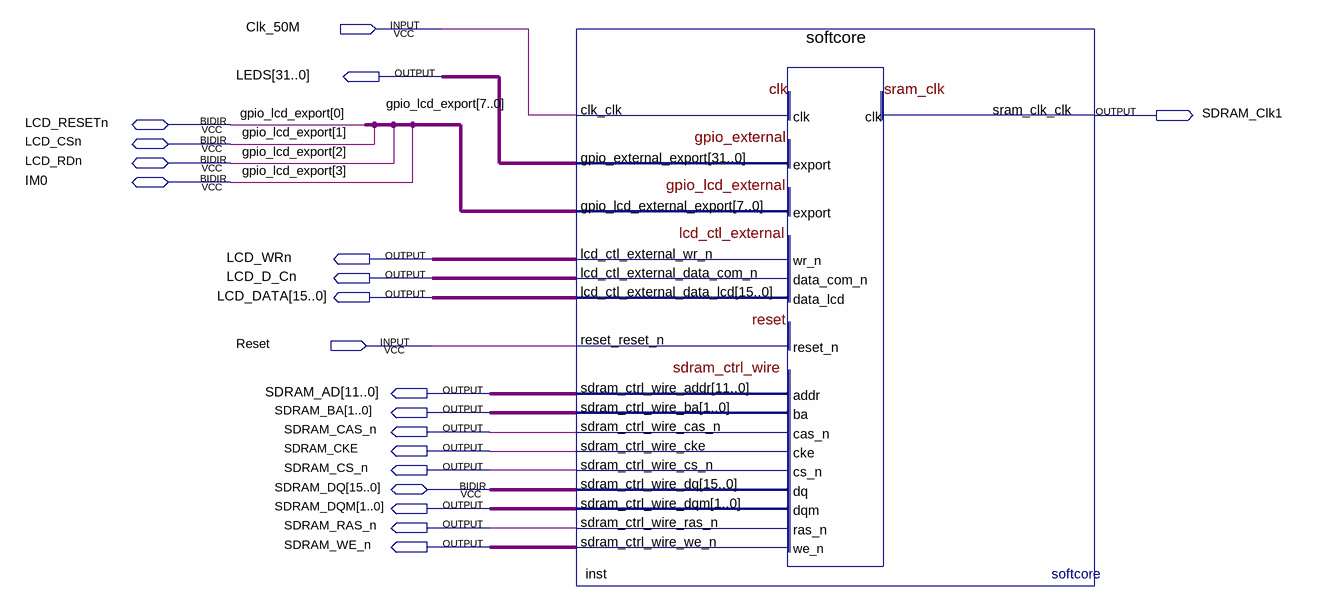
[diagram p0: schematic sheet]
// Quartus schematic main_project.bdf as structural Verilog: 1 symbols, 20 pins
module main_project (
  input  Clk_50M,
  input  Reset,
  inout  LCD_RESETn,
  inout  LCD_CSn,
  inout  LCD_RDn,
  inout  IM0,
  inout  [15:0] SDRAM_DQ,
  output [31:0] LEDS,
  output SDRAM_Clk1,
  output LCD_WRn,
  output LCD_D_Cn,
  output [15:0] LCD_DATA,
  output [11:0] SDRAM_AD,
  output [1:0] SDRAM_BA,
  output SDRAM_CAS_n,
  output SDRAM_CKE,
  output SDRAM_CS_n,
  output [1:0] SDRAM_DQM,
  output SDRAM_RAS_n,
  output SDRAM_WE_n
);

  wire [7:4] gpio_lcd_export;

  softcore inst (
    .clk_clk(Clk_50M), .reset_reset_n(Reset), .lcd_ctl_external_wr_n(LCD_WRn),
    .lcd_ctl_external_data_com_n(LCD_D_Cn), .lcd_ctl_external_data_lcd(LCD_DATA),
    .sdram_ctrl_wire_addr(SDRAM_AD), .sdram_ctrl_wire_ba(SDRAM_BA), .sdram_ctrl_wire_cas_n(SDRAM_CAS_n),
    .sdram_ctrl_wire_cke(SDRAM_CKE), .sdram_ctrl_wire_cs_n(SDRAM_CS_n), .sdram_ctrl_wire_dqm(SDRAM_DQM),
    .sdram_ctrl_wire_ras_n(SDRAM_RAS_n), .sdram_ctrl_wire_we_n(SDRAM_WE_n), .sram_clk_clk(SDRAM_Clk1),
    .gpio_external_export(LEDS),
    .gpio_lcd_external_export({gpio_lcd_export, IM0, LCD_RDn, LCD_CSn, LCD_RESETn}),
    .sdram_ctrl_wire_dq(SDRAM_DQ));

  // Other names for the same wires on the sheet: gpio_lcd_export[3:0] = {IM0, LCD_RDn, LCD_CSn, LCD_RESETn}
endmodule
